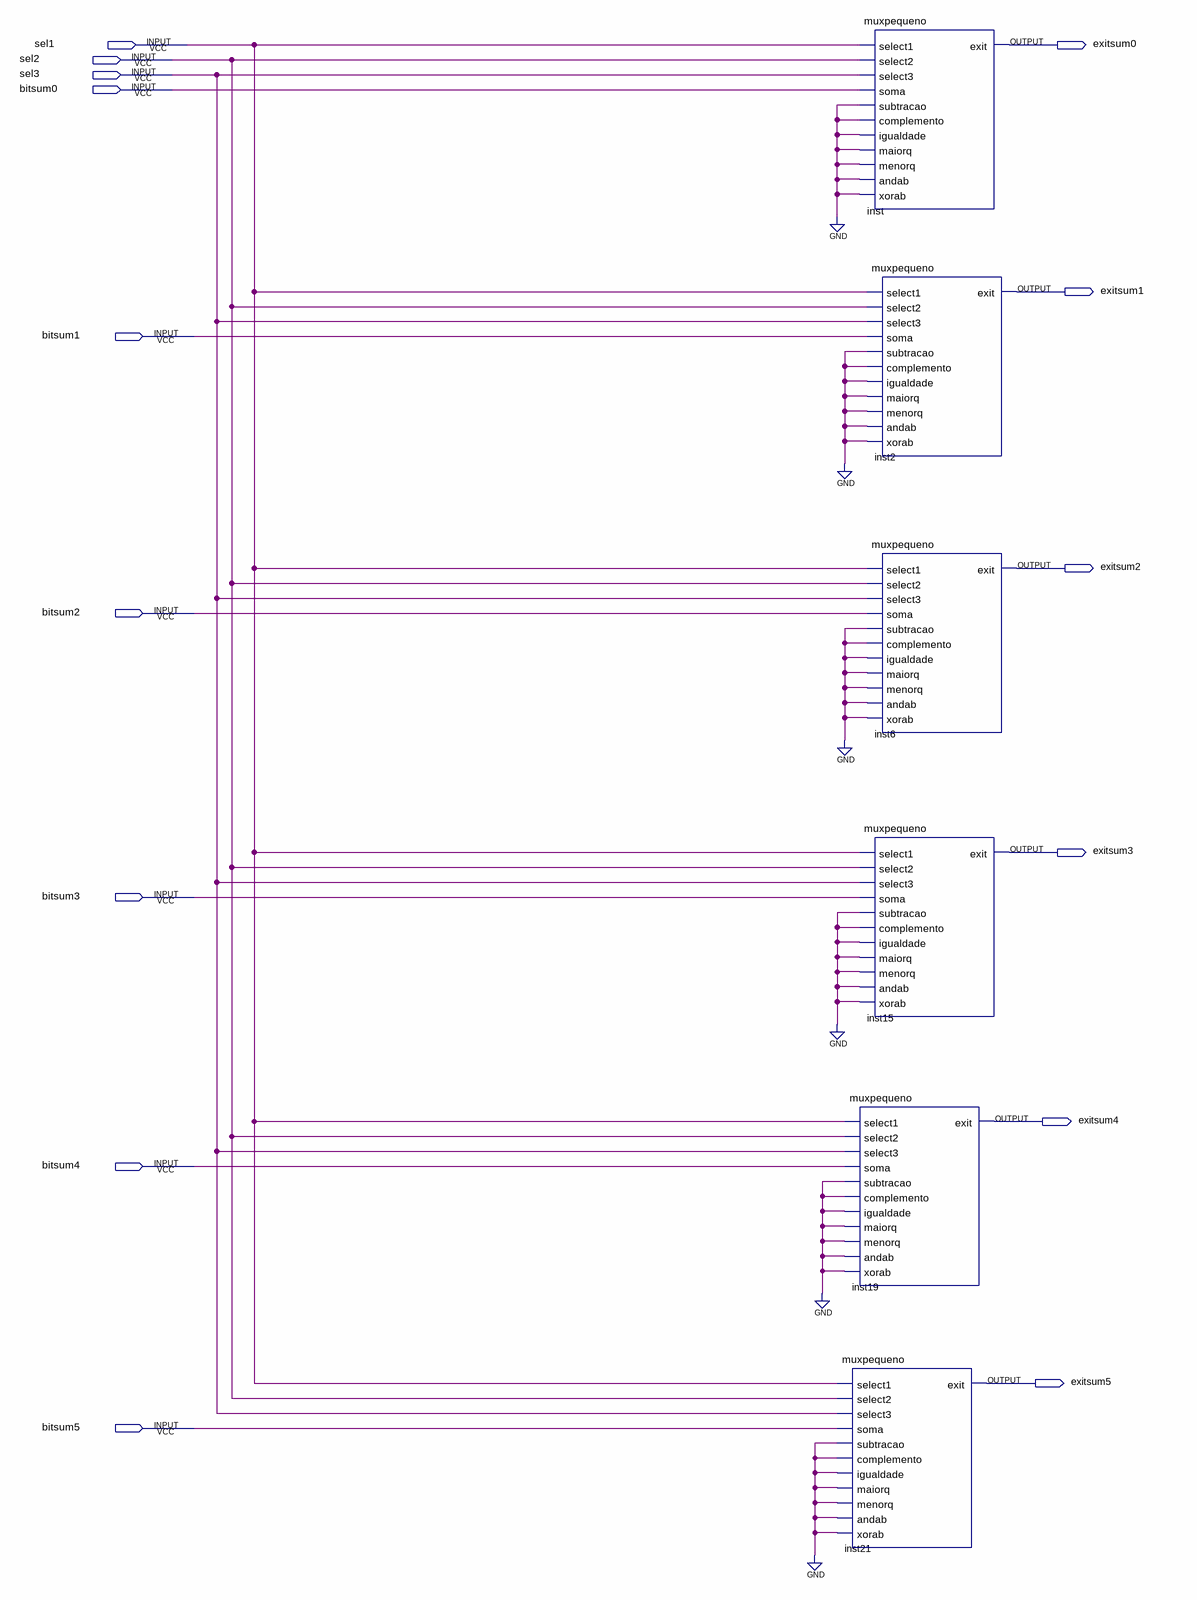
[diagram p0: schematic sheet]
// Quartus schematic muxsum.bdf as structural Verilog: 6 symbols, 15 pins
module muxsum (
  input  sel1,
  input  sel2,
  input  sel3,
  input  bitsum0,
  input  bitsum1,
  input  bitsum2,
  input  bitsum3,
  input  bitsum4,
  input  bitsum5,
  output exitsum0,
  output exitsum1,
  output exitsum2,
  output exitsum3,
  output exitsum4,
  output exitsum5
);

  muxpequeno inst (
    .select1(sel1), .select2(sel2), .select3(sel3), .soma(bitsum0), .subtracao(1'b0), .complemento(1'b0),
    .igualdade(1'b0), .maiorq(1'b0), .menorq(1'b0), .andab(1'b0), .xorab(1'b0), .exit(exitsum0));
  muxpequeno inst2 (
    .select1(sel1), .select2(sel2), .select3(sel3), .soma(bitsum1), .subtracao(1'b0), .complemento(1'b0),
    .igualdade(1'b0), .maiorq(1'b0), .menorq(1'b0), .andab(1'b0), .xorab(1'b0), .exit(exitsum1));
  muxpequeno inst6 (
    .select1(sel1), .select2(sel2), .select3(sel3), .soma(bitsum2), .subtracao(1'b0), .complemento(1'b0),
    .igualdade(1'b0), .maiorq(1'b0), .menorq(1'b0), .andab(1'b0), .xorab(1'b0), .exit(exitsum2));
  muxpequeno inst15 (
    .select1(sel1), .select2(sel2), .select3(sel3), .soma(bitsum3), .subtracao(1'b0), .complemento(1'b0),
    .igualdade(1'b0), .maiorq(1'b0), .menorq(1'b0), .andab(1'b0), .xorab(1'b0), .exit(exitsum3));
  muxpequeno inst19 (
    .select1(sel1), .select2(sel2), .select3(sel3), .soma(bitsum4), .subtracao(1'b0), .complemento(1'b0),
    .igualdade(1'b0), .maiorq(1'b0), .menorq(1'b0), .andab(1'b0), .xorab(1'b0), .exit(exitsum4));
  muxpequeno inst21 (
    .select1(sel1), .select2(sel2), .select3(sel3), .soma(bitsum5), .subtracao(1'b0), .complemento(1'b0),
    .igualdade(1'b0), .maiorq(1'b0), .menorq(1'b0), .andab(1'b0), .xorab(1'b0), .exit(exitsum5));
endmodule
